# EAGLE design control (EAGLE 7.4.0)
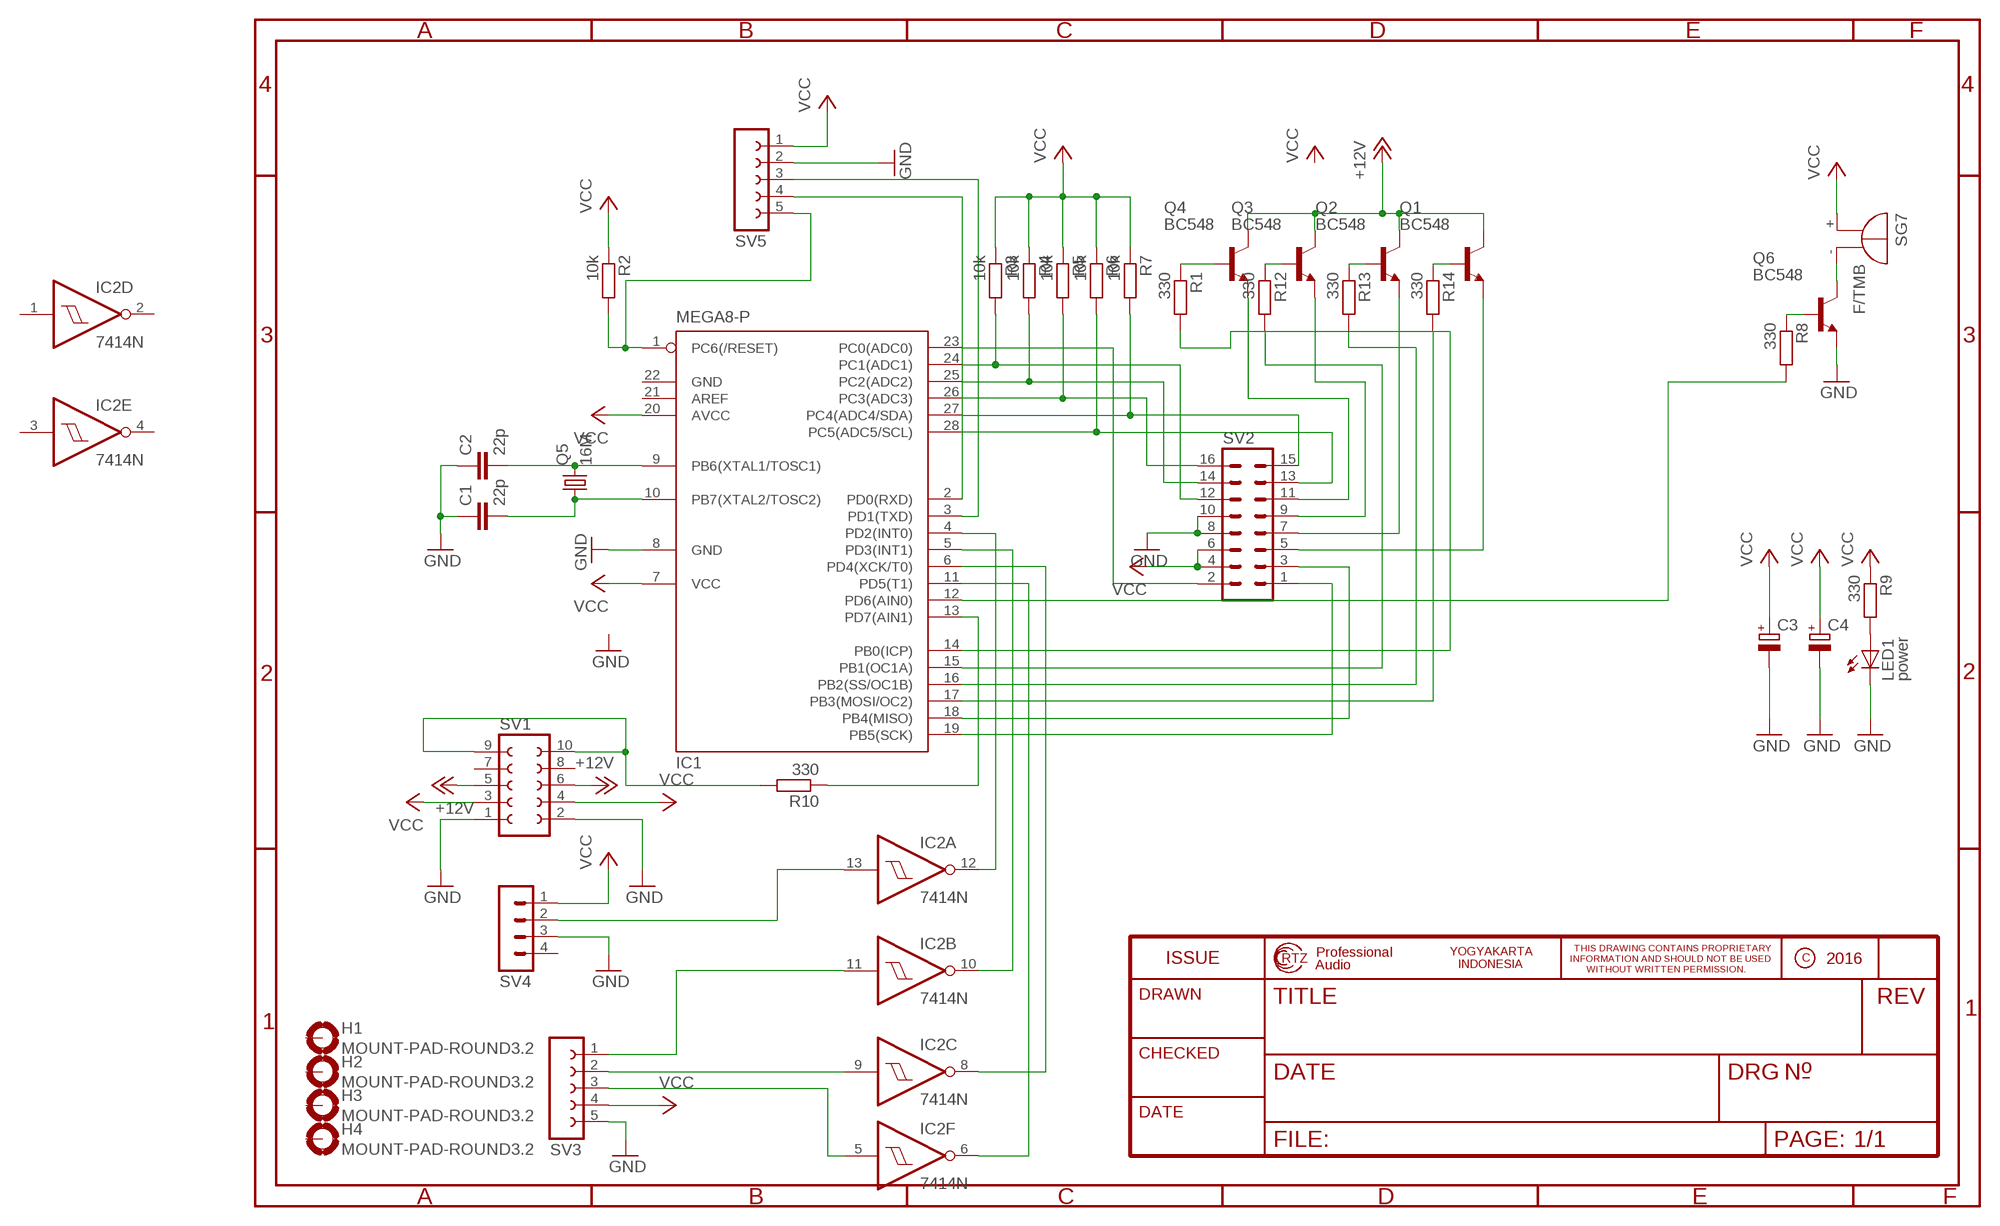
[diagram p0: schematic, sheet 1]

## Parts
C1  22p  C-EU025-025X050  [C025-025X050]
C2  22p  C-EU025-025X050  [C025-025X050]
C3  CPOL-EUB45181B  [B45181B]
C4  CPOL-EUB45181B  [B45181B]
H1  MOUNT-PAD-ROUND3.2  [3,2-PAD]
H2  MOUNT-PAD-ROUND3.2  [3,2-PAD]
H3  MOUNT-PAD-ROUND3.2  [3,2-PAD]
H4  MOUNT-PAD-ROUND3.2  [3,2-PAD]
IC1  MEGA8-P  [DIL28-3]
IC2  7414N  [DIL14]
LED1  power  LED5MM  [LED5MM]
Q1  BC548  [TO92-EBC]
Q2  BC548  [TO92-EBC]
Q3  BC548  [TO92-EBC]
Q4  BC548  [TO92-EBC]
Q5  16M  CRYSTALHC49U-V  [HC49U-V]
Q6  BC548  [TO92-EBC]
R1  330  R-EU_0207/7  [0207/7]
R2  10k  R-EU_0207/7  [0207/7]
R3  10k  R-EU_0207/7  [0207/7]
R4  10k  R-EU_0207/7  [0207/7]
R5  10k  R-EU_0207/7  [0207/7]
R6  10k  R-EU_0207/7  [0207/7]
R7  10k  R-EU_0207/7  [0207/7]
R8  330  R-EU_0207/7  [0207/7]
R9  330  R-EU_0207/7  [0207/7]
R10  330  R-EU_0207/7  [0207/7]
R12  330  R-EU_0207/7  [0207/7]
R13  330  R-EU_0207/7  [0207/7]
R14  330  R-EU_0207/7  [0207/7]
SG7  F/TMB  [F/TMB]
SV1  FE05-2  [FE05-2]
SV2  MA08-2  [MA08-2]
SV3  FE05-1  [FE05-1]
SV4  MA04-1  [MA04-1]
SV5  FE05-1  [FE05-1]

## Nets
+12V: Q1.C Q2.C Q3.C Q4.C SV1.5 SV1.6
GND: C1.1 C2.1 C3.- C4.- IC1.8(GND) LED1.K(C) Q6.E SV1.1 SV1.2 SV2.8 SV2.10 SV3.5 SV4.3 SV5.2
N$1: IC1.1(PC6(/RESET)) R2.2 SV5.5
N$2: C1.2 IC1.10(PB7(XTAL2/TOSC2)) Q5.1
N$3: C2.2 IC1.9(PB6(XTAL1/TOSC1)) Q5.2
N$4: IC1.24(PC1(ADC1)) R3.2 SV2.12
N$5: IC1.23(PC0(ADC0)) SV2.2
N$6: IC1.15(PB1(OC1A)) R12.2
N$7: IC1.16(PB2(SS/OC1B)) R13.2
N$8: IC1.17(PB3(MOSI/OC2)) R14.2
N$11: IC1.28(PC5(ADC5/SCL)) R6.2 SV2.13
N$13: Q4.B R1.1
N$14: Q6.C SG7.-
N$15: Q6.B R8.1
N$16: LED1.A R9.2
N$17: R10.2 SV1.9 SV1.10
N$18: IC1.4(PD2(INT0)) IC2.12(A:O)
N$19: IC1.13(PD7(AIN1)) R10.1
N$20: IC1.5(PD3(INT1)) IC2.10(B:O)
N$21: Q3.B R12.1
N$22: IC1.6(PD4(XCK/T0)) IC2.8(C:O)
N$23: IC1.12(PD6(AIN0)) R8.2
N$24: Q4.E SV2.11
N$25: Q2.E SV2.7
N$26: Q3.E SV2.9
N$27: IC2.13(A:I) SV4.2
N$28: Q1.E SV2.5
N$29: Q2.B R13.1
N$30: Q1.B R14.1
N$31: IC2.11(B:I) SV3.1
N$32: IC2.9(C:I) SV3.2
N$33: IC2.5(F:I) SV3.3
N$34: IC1.11(PD5(T1)) IC2.6(F:O)
N$35: IC1.27(PC4(ADC4/SDA)) R7.2 SV2.15
N$36: IC1.2(PD0(RXD)) SV5.4
N$37: IC1.3(PD1(TXD)) SV5.3
N$38: IC1.14(PB0(ICP)) R1.2
N$39: IC1.19(PB5(SCK)) SV2.1
N$40: IC1.18(PB4(MISO)) SV2.3
N$47: IC1.25(PC2(ADC2)) R4.2 SV2.14
N$48: IC1.26(PC3(ADC3)) R5.2 SV2.16
VCC: C3.+ C4.+ IC1.7(VCC) IC1.20(AVCC) R2.1 R3.1 R4.1 R5.1 R6.1 R7.1 R9.1 SG7.+ SV1.3 SV1.4 SV2.4 SV2.6 SV3.4 SV4.1 SV5.1
Unconnected: H1.B3,2(MOUNT) H2.B3,2(MOUNT) H3.B3,2(MOUNT) H4.B3,2(MOUNT) IC1.21(AREF) IC2.1(D:I) IC2.2(D:O) IC2.3(E:I) IC2.4(E:O) SV1.7 SV1.8 SV4.4

## Power pins joined to a net without a drawn wire
GND: IC1.22(GND) IC2.7(P:GND)
VCC: IC2.14(P:VCC)

## Library data of the parts
C1 C2 = rcl:C-EU: CAPACITOR, European symbol
C3 C4 = rcl:CPOL-EU: POLARIZED CAPACITOR, European symbol
H1-H4 = holes:MOUNT-PAD-ROUND: MOUNTING PAD, round
IC1 = atmel:MEGA8-P: MICROCONTROLLER 8 Kbytes FLASH, 1 kbytes SRAM, 512 bytes EEPROM, USART, 4-channel 10 bit ADC, 2-channel 8 bit ADC Pin compatible with Atmega48, ATMega88, ATMega168 Source: avr.lbr; OC_FARNELL: unknown; OC_NEWARK: unknown
IC2 = 74xx-eu:74*14: Hex schmitt trigger INVERTER
LED1 = led:LED: LED OSRAM: - CHIPLED LG R971, LG N971, LY N971, LG Q971, LY Q971, LO R971, LY R971 LH N974, LH R974 LS Q976, LO Q976, LY Q976 LO Q996 - Hyper CHIPLED LW Q18S LB Q993, LB Q99A, LB R99A - SideLED LS A670, LO A670, LY A670, LG A670, LP A670 LB A673, LV A673, LT A673, LW A673 LH A674 LY A675 LS A676, LA A676, LO A676, LY A676, LW A676 LS A679, LY A679, LG A679 - Hyper Micro SIDELED® LS Y876, LA Y876, LO Y876, LY Y876 LT Y87S - SmartLED LW L88C, LW L88S LB L89C, LB L89S, LG L890 LS L89K, LO L89K, LY L89K LS L896, LA L896, LO L896, LY L896 - TOPLED LS T670, LO T670, LY T670, LG T670, LP T670 LSG T670, LSP T670, LSY T670, LOP T670, LYG T670 LG T671, LOG T671, LSG T671 LB T673, LV T673, LT T673, LW T673 LH T674 LS T676, LA T676, LO T676, LY T676, LB T676, LH T676, LSB T676, LW T676 LB T67C, LV T67C, LT T67C, LS T67K, LO T67K, LY T67K, LW E67C LS E67B, LA E67B, LO E67B, LY E67B, LB E67C, LV E67C, LT E67C LW T67C LS T679, LY T679, LG T679 LS T770, LO T770, LY T770, LG T770, LP T770 LB T773, LV T773, LT T773, LW T773 LH T774 LS E675, LA E675, LY E675, LS T675 LS T776, LA T776, LO T776, LY T776, LB T776 LHGB T686 LT T68C, LB T68C - Hyper Mini TOPLED® LB M676 - Mini TOPLED Santana® LG M470 LS M47K, LO M47K, LY M47K Source: http://www.osram.convergy.de LUXEON: - LUMILED® LXK2-PW12-R00, LXK2-PW12-S00, LXK2-PW14-U00, LXK2-PW14-V00 LXK2-PM12-R00, LXK2-PM12-S00, LXK2-PM14-U00 LXK2-PE12-Q00, LXK2-PE12-R00, LXK2-PE12-S00, LXK2-PE14-T00, LXK2-PE14-U00 LXK2-PB12-K00, LXK2-PB12-L00, LXK2-PB12-M00, LXK2-PB14-N00, LXK2-PB14-P00, LXK2-PB14-Q00 LXK2-PR12-L00, LXK2-PR12-M00, LXK2-PR14-Q00, LXK2-PR14-R00 LXK2-PD12-Q00, LXK2-PD12-R00, LXK2-PD12-S00 LXK2-PH12-R00, LXK2-PH12-S00 LXK2-PL12-P00, LXK2-PL12-Q00, LXK2-PL12-R00 Source: www.luxeon.com KINGBRIGHT: KA-3528ASYC Source: www.kingbright.com
Q1-Q4 Q6 = transistor-npn:BC548*: NPN Transistor
Q5 = crystal:CRYSTAL: CRYSTAL; OC_FARNELL: 1666969; OC_NEWARK: unknown
R1-R10 R12-R14 = rcl:R-EU_: RESISTOR, European symbol
SG7 = buzzer:F/TMB: BUZZER Source: Buerklin; OC_FARNELL: unknown; OC_NEWARK: unknown
SV1 = con-lsta:FE05-2: FEMALE HEADER; OC_FARNELL: unknown; OC_NEWARK: unknown
SV2 = con-lstb:MA08-2: PIN HEADER; OC_FARNELL: unknown; OC_NEWARK: unknown
SV3 SV5 = con-lsta:FE05-1: FEMALE HEADER; OC_FARNELL: unknown; OC_NEWARK: unknown
SV4 = con-lstb:MA04-1: PIN HEADER; OC_FARNELL: unknown; OC_NEWARK: unknown

## Board
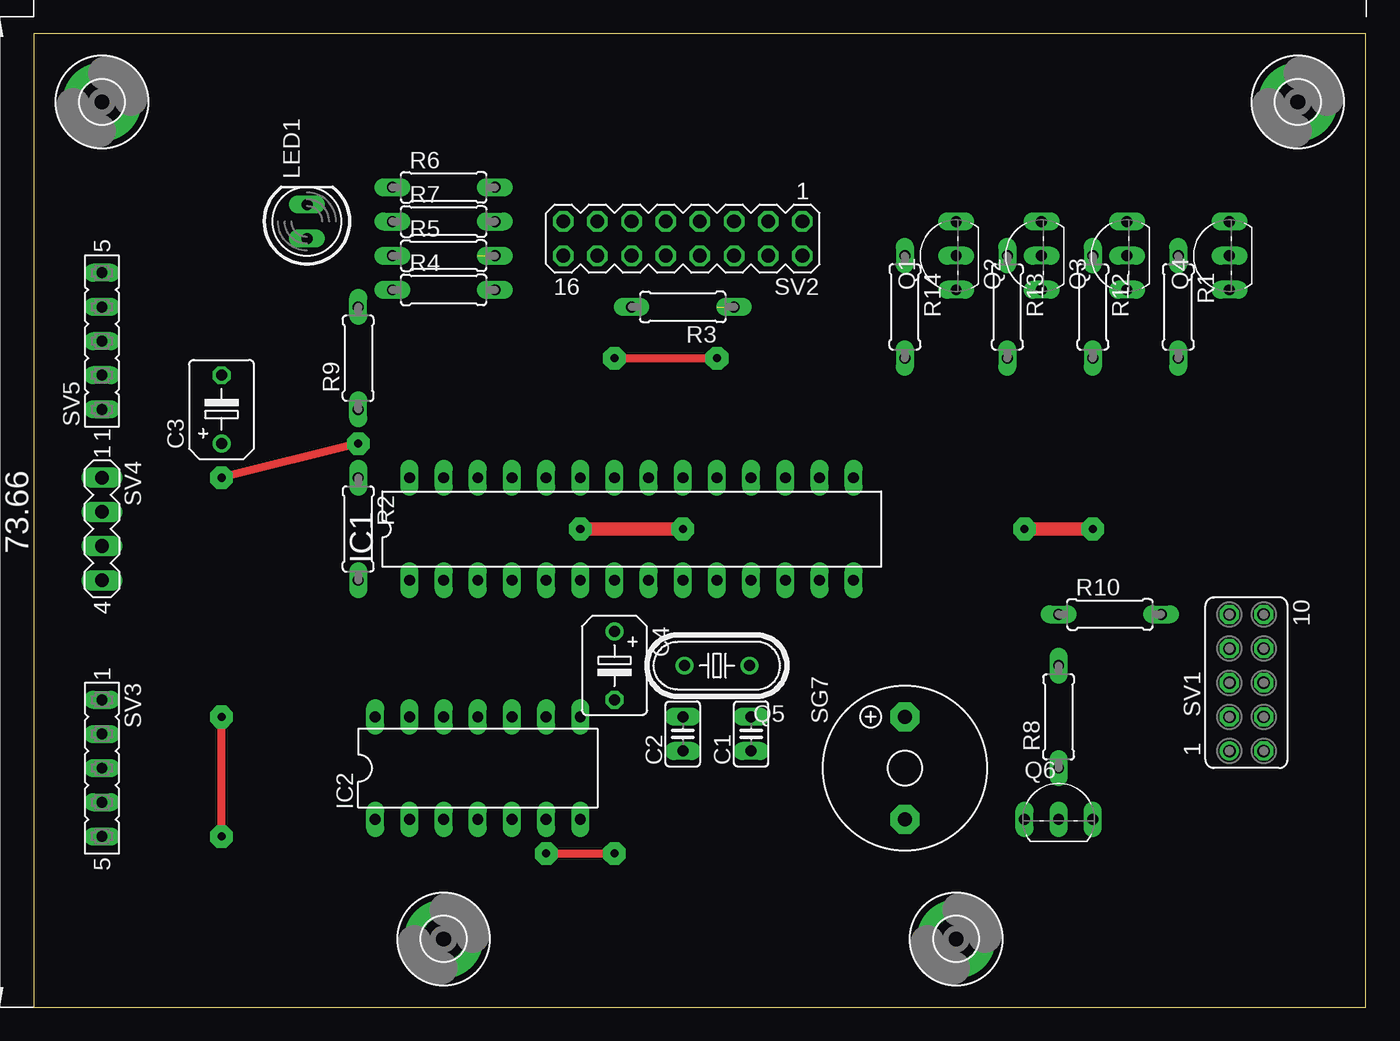
[diagram p1: board, top side]
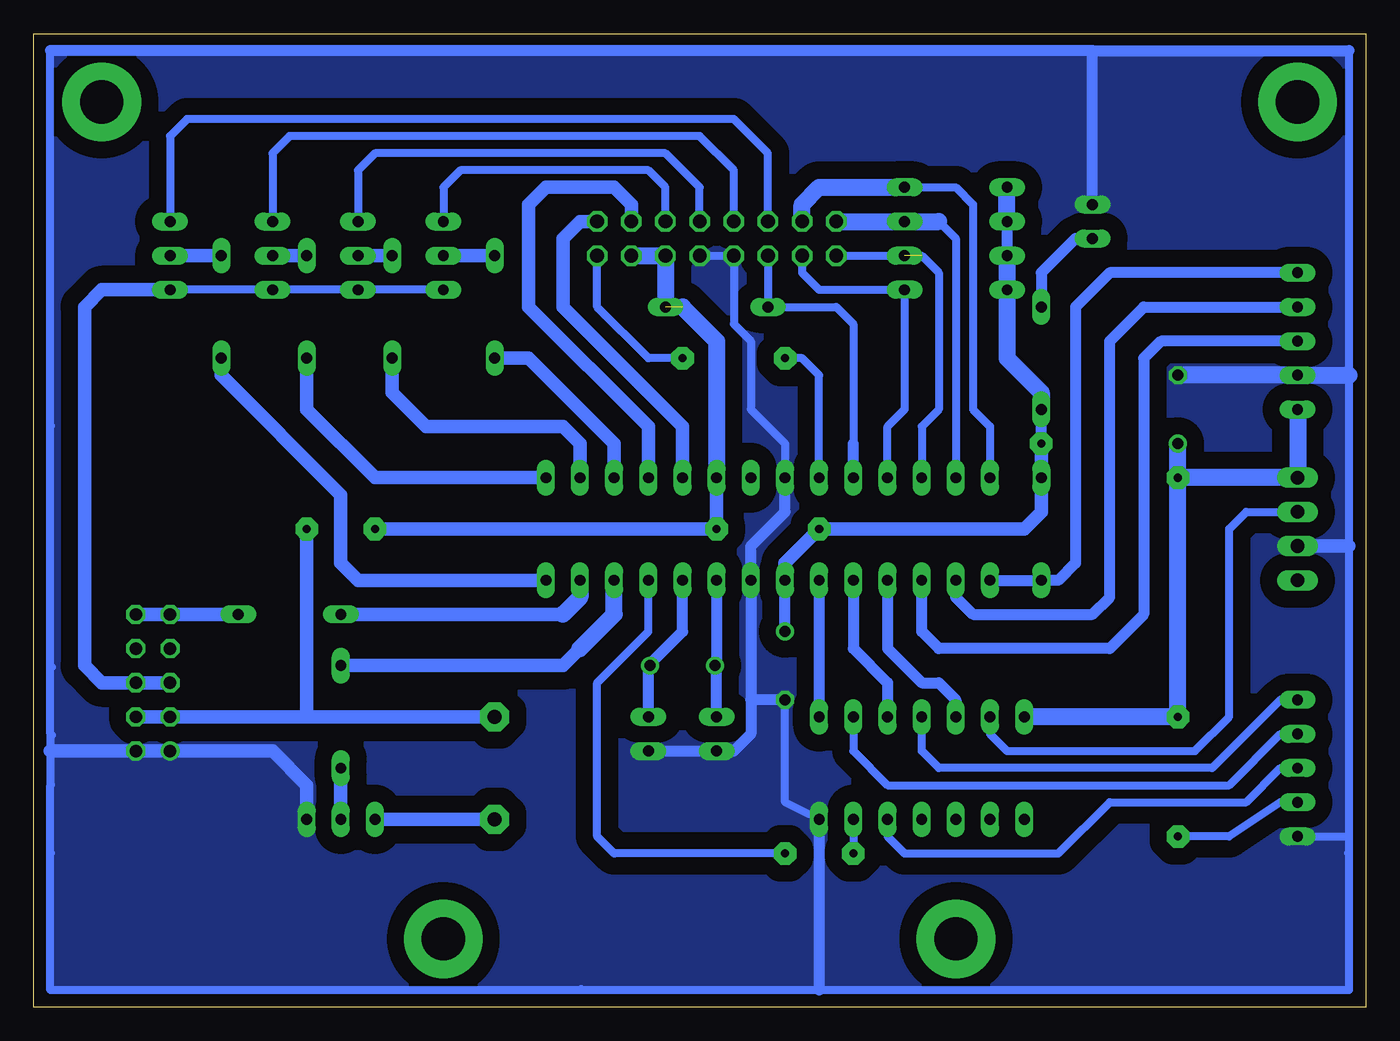
[diagram p2: board, bottom side, seen from below]

Size 99.04 x 72.39 mm. Coordinates in mm from the lower left corner, seen from the top.
Outline: 0,0 99.04,0 99.04,72.39 0,72.39 0,0
Copper layers (1*16): Top 0.035mm / dielectric 1.5mm / Bottom 0.035mm
Design rules "default": minimum track width 10mil, minimum drill 24mil, track to track 8mil, track to pad 8mil, pad to pad 8mil, via to via 8mil, smd to smd 8mil, copper to edge 40mil, drill to drill 8mil, minimum pad ring 10mil, minimum via ring 8mil, stop-mask expansion 4mil, vias tented up to drill 0mil, thermal gap 10mil

### Footprints (pad centres in the part's own frame; a part is rotated, then mirrored left to right if it is on the bottom)
C025-025X050 = drill 0.813 long: 1 -1.27,0; 2 1.27,0
B45181B = drill 0.813: + -2.54,0 | drill 0.813 octagon: - 2.54,0
3,2-PAD = drill 3.2 pad 5.842: B3,2 0,0
DIL28-3 = drill 0.813 long: 1 -16.51,-3.81; 2 -13.97,-3.81; 3 -11.43,-3.81; 4 -8.89,-3.81; 5 -6.35,-3.81; 6 -3.81,-3.81; 7 -1.27,-3.81; 8 1.27,-3.81; 9 3.81,-3.81; 10 6.35,-3.81; 11 8.89,-3.81; 12 11.43,-3.81; 13 13.97,-3.81; 14 16.51,-3.81; 15 16.51,3.81; 16 13.97,3.81; 17 11.43,3.81; 18 8.89,3.81; 19 6.35,3.81; 20 3.81,3.81; 21 1.27,3.81; 22 -1.27,3.81; 23 -3.81,3.81; 24 -6.35,3.81; 25 -8.89,3.81; 26 -11.43,3.81; 27 -13.97,3.81; 28 -16.51,3.81
DIL14 = drill 0.813 long: 1 -7.62,-3.81; 2 -5.08,-3.81; 3 -2.54,-3.81; 4 0,-3.81; 5 2.54,-3.81; 6 5.08,-3.81; 7 7.62,-3.81; 8 7.62,3.81; 9 5.08,3.81; 10 2.54,3.81; 11 0,3.81; 12 -2.54,3.81; 13 -5.08,3.81; 14 -7.62,3.81
LED5MM = drill 0.813 long: A -1.27,0; K 1.27,0
TO92-EBC = drill 0.813 long: B 0,-1.27; C -2.54,-1.27; E 2.54,-1.27
HC49U-V = drill 0.813: 1 -2.413,0; 2 2.413,0
0207/7 = drill 0.813 long: 1 -3.81,0; 2 3.81,0
F/TMB = drill 1.016 pad 2.159 octagon: + 3.81,0; - -3.81,0
FE05-2 = drill 0.914: 1 -5.08,1.27 | drill 0.914 octagon: 2 -5.08,-1.27; 3 -2.54,1.27; 4 -2.54,-1.27; 5 0,1.27; 6 0,-1.27; 7 2.54,1.27; 8 2.54,-1.27; 9 5.08,1.27; 10 5.08,-1.27
MA08-2 = drill 1.016 octagon: 1 -8.89,-1.27; 2 -8.89,1.27; 3 -6.35,-1.27; 4 -6.35,1.27; 5 -3.81,-1.27; 6 -3.81,1.27; 7 -1.27,-1.27; 8 -1.27,1.27; 9 1.27,-1.27; 10 1.27,1.27; 11 3.81,-1.27; 12 3.81,1.27; 13 6.35,-1.27; 14 6.35,1.27; 15 8.89,-1.27; 16 8.89,1.27
FE05-1 = drill 0.813 long: 1 -5.08,0; 2 -2.54,0; 3 0,0; 4 2.54,0; 5 5.08,0
MA04-1 = drill 1.016 long: 1 -3.81,0; 2 -1.27,0; 3 1.27,0; 4 3.81,0

### Placement (x,y rotation side)
C1  53.34,20.32 90 top
C2  48.26,20.32 90 top
C3  13.97,44.45 90 top
C4  43.18,25.4 270 top
H1  30.48,5.08 0 top
H2  68.58,5.08 0 top
H3  5.08,67.31 0 top
H4  93.98,67.31 0 top
IC1  44.45,35.56 0 top
IC2  33.02,17.78 0 top
LED1  20.32,58.42 90 top
Q1  67.31,55.88 90 top
Q2  73.66,55.88 90 top
Q3  80.01,55.88 90 top
Q4  87.63,55.88 90 top
Q5  50.8,25.4 180 top
Q6  76.2,15.24 0 top
R1  85.09,52.07 270 top
R2  24.13,35.56 270 top
R3  48.26,52.07 180 top
R4  30.48,53.34 0 top
R5  30.48,55.88 0 top
R6  30.48,60.96 0 top
R7  30.48,58.42 0 top
R8  76.2,21.59 90 top
R9  24.13,48.26 90 top
R10  80.01,29.21 0 top
R12  78.74,52.07 270 top
R13  72.39,52.07 270 top
R14  64.77,52.07 270 top
SG7  64.77,17.78 90 top
SV1  90.17,24.13 90 top
SV2  48.26,57.15 180 top
SV3  5.08,17.78 270 top
SV4  5.08,35.56 270 top
SV5  5.08,49.53 90 top

### Tracks (layer width: path | path; a pad name or v marks a point on that pad's centre or on a via)
+12V
  Bottom 0.61: Q1.C Q2.C Q3.C Q4.C
  Bottom 1.016: Q4.C 93.98,53.34 95.25,52.07 95.25,25.4 93.98,24.13 SV1.6 SV1.5
GND
  Bottom 0.61: 97.74,43.23 97.79,43.18 | 97.79,43.18 97.79,71.12 | 1.27,71.12 1.27,46.99 1.27,34.29 1.27,12.7 | 1.27,12.7 1.27,11.43 | 1.27,11.43 1.27,1.27 40.64,1.27 58.42,1.27 | 58.42,1.27 97.79,1.27 97.79,11.43 | 97.79,11.43 97.79,16.51 | 97.79,20.32 97.79,19.05 97.79,16.51 | 97.79,20.32 97.79,25.4 | 97.79,25.4 97.79,43.18 | 97.74,16.56 97.79,16.51 | 97.74,11.48 97.79,11.43 | 58.32,1.37 58.42,1.27 | 1.32,11.48 1.27,11.43 | 97.69,25.3 97.79,25.4 | 97.69,20.22 97.79,20.32 | SV3.5 1.27,12.7 | IC2.7 43.18,15.24 C4.- | IC1.22 43.18,41.91 45.72,44.45 45.72,49.53 46.99,50.8 SV2.10 SV2.8
  Bottom 0.813: C1.1 C2.1 46.99,19.05 45.72,20.32 45.72,22.86 | 45.72,22.86 IC1.8 45.72,34.29 43.18,36.83 IC1.22 | 20.32,71.12 97.79,71.12 | LED1.K 20.32,71.12 | 20.32,71.12 1.27,71.12 | C4.- 45.72,22.86 | IC2.7 40.64,1.27
  Bottom 1.016: SV4.3 1.27,34.29 | 97.79,19.05 SV1.2 SV1.1 81.28,19.05 78.74,16.51 Q6.E
  Bottom 1.27: 1.27,46.99 SV5.2 C3.-
  pour Bottom (isolate 1.27, no thermals): 0,72.39 99.06,72.39 101.6,-1.27 0,0
N$1
  Bottom 0.813: IC1.1 R2.2 22.86,31.75 21.59,33.02 21.59,52.07 19.05,54.61 SV5.5
N$2
  Bottom 0.813: C1.2 53.34,25.27 Q5.1 53.21,25.53 50.8,27.94 IC1.10
N$3
  Bottom 0.813: IC1.9 48.26,25.53 Q5.2 48.26,25.27 C2.2
N$4
  Bottom 0.61: 38.1,41.91 38.1,50.8 39.37,52.07 R3.2 SV2.12
  Bottom 0.813: IC1.24 38.1,41.91
N$5  (via drill 0.6 pad 1.68)
  Top 0.61: v43.18,48.26 v50.8,48.26
  Bottom 0.61: IC1.23 40.64,46.99 41.91,48.26 v43.18,48.26 | v50.8,48.26 53.34,48.26 57.15,52.07 SV2.2
N$6
  Bottom 1.016: R12.2 78.74,44.45 73.66,39.37 IC1.15
N$7
  Bottom 1.016: IC1.16 58.42,41.91 59.69,43.18 69.85,43.18 72.39,45.72 R13.2
N$8
  Bottom 1.016: IC1.17 55.88,41.91 62.23,48.26 R14.2
N$11
  Bottom 0.61: R6.2 30.48,60.96 29.21,59.69 29.21,44.45 27.94,43.18 IC1.28
  Bottom 1.27: SV2.13 41.91,59.69 40.64,60.96 R6.2
N$13
  Bottom 1.016: Q4.B R1.1
N$14
  Bottom 1.016: Q6.C SG7.-
N$15
  Bottom 1.016: Q6.B R8.1
N$16
  Bottom 0.813: LED1.A 21.59,57.15 24.13,54.61 R9.2
N$17
  Bottom 1.016: R10.2 SV1.9 SV1.10
N$18
  Bottom 0.813: IC1.4 35.56,26.67 33.02,24.13 31.75,24.13 30.48,22.86 IC2.12
N$19
  Bottom 1.016: 59.69,29.21 R10.1
  Bottom 1.27: IC1.13 58.42,30.48 59.69,29.21
N$20
  Bottom 0.813: IC1.5 38.1,26.67 35.56,24.13 IC2.10
N$21
  Bottom 1.016: Q3.B R12.1
N$22
  Bottom 0.813: IC1.6 IC2.8
N$23
  Bottom 1.016: R8.2 59.69,25.4 58.42,26.67
  Bottom 1.27: 58.42,26.67 55.88,29.21 IC1.12
N$24
  Bottom 0.61: SV2.11 44.45,63.5 46.99,66.04 87.63,66.04 88.9,64.77 Q4.E
N$25
  Bottom 0.61: SV2.7 49.53,60.96 52.07,63.5 73.66,63.5 74.93,62.23 Q2.E
N$26
  Bottom 0.61: SV2.9 46.99,62.23 49.53,64.77 80.01,64.77 81.28,63.5 Q3.E
N$27
  Bottom 0.61: IC2.13 27.94,20.32 26.67,19.05 12.7,19.05 10.16,21.59 10.16,35.56 8.89,36.83 SV4.2
N$28
  Bottom 0.61: SV2.5 52.07,60.96 53.34,62.23 67.31,62.23 68.58,60.96 Q1.E
N$29
  Bottom 1.016: Q2.B R13.1
N$30
  Bottom 1.016: Q1.B R14.1
N$31
  Bottom 0.61: SV3.1 6.35,22.86 11.43,17.78 31.75,17.78 33.02,19.05 IC2.11
N$32
  Bottom 0.61: IC2.9 38.1,19.05 35.56,16.51 10.16,16.51 6.35,20.32 SV3.2
N$33
  Bottom 0.61: IC2.5 35.56,12.7 34.29,11.43 22.86,11.43 19.05,15.24 8.89,15.24 6.35,17.78 SV3.3
N$34  (via drill 0.6 pad 1.68)
  Top 0.61: v38.1,11.43 v43.18,11.43
  Bottom 0.61: IC2.6 v38.1,11.43 | v43.18,11.43 55.88,11.43 57.15,12.7 57.15,24.13 53.34,27.94 IC1.11
N$35
  Bottom 0.61: 31.75,58.42 30.48,57.15 IC1.27
  Bottom 1.27: SV2.15 R7.2 31.75,58.42
N$36
  Bottom 0.813: IC1.2 30.48,30.48 29.21,29.21 20.32,29.21 19.05,30.48 19.05,49.53 16.51,52.07 SV5.4
N$37
  Bottom 0.813: SV5.3 15.24,49.53 16.51,48.26 16.51,29.21 19.05,26.67 31.75,26.67 33.02,27.94 IC1.3
N$38
  Bottom 1.016: IC1.14 74.93,31.75 76.2,33.02 76.2,38.1 85.09,46.99 R1.2
N$39
  Bottom 1.016: SV2.1 58.42,58.42 59.69,57.15 59.69,52.07 50.8,43.18 IC1.19
N$40
  Bottom 1.016: IC1.18 53.34,43.18 62.23,52.07 62.23,59.69 60.96,60.96 55.88,60.96 54.61,59.69 SV2.3
N$47
  Bottom 0.61: IC1.25 35.56,43.18 34.29,44.45 R4.2 40.64,53.34 41.91,54.61 SV2.14
N$48  (1 unrouted)
  Bottom 0.61: IC1.26 33.02,43.18 31.75,44.45 31.75,54.61 33.02,55.88 SV2.16
VCC  (via drill 0.6 pad 1.68)  (1 unrouted)
  Top 0.61: v13.97,12.7 v13.97,21.59 | v24.13,41.91 v13.97,39.37
  Top 1.016: v73.66,35.56 v78.74,35.56 | v40.64,35.56 v48.26,35.56
  Bottom 0.61: SV3.4 6.35,15.24 10.16,12.7 v13.97,12.7
  Bottom 0.813: IC1.20 48.26,41.91 | R7.1 R5.1 | v24.13,41.91 R9.1 | C4.+ IC1.7
  Bottom 1.016: SV1.4 SV1.3 78.74,21.59 | 78.74,21.59 SG7.+ | IC1.20 v48.26,35.56 v73.66,35.56 | v78.74,35.56 78.74,21.59 | IC1.7 43.18,33.02 v40.64,35.56 25.4,35.56 24.13,36.83 R2.1 v24.13,41.91
  Bottom 1.27: IC2.14 v13.97,21.59 v13.97,39.37 | SV5.1 SV4.1 v13.97,39.37 | v13.97,39.37 C3.+ | SV2.4 SV2.6 R3.1 | R5.1 R4.1 26.67,48.26 24.13,45.72 R9.1 | R7.1 R6.1 | 50.8,52.07 48.26,49.53 IC1.20